# EAGLE design mutex (EAGLE 9.6.2)
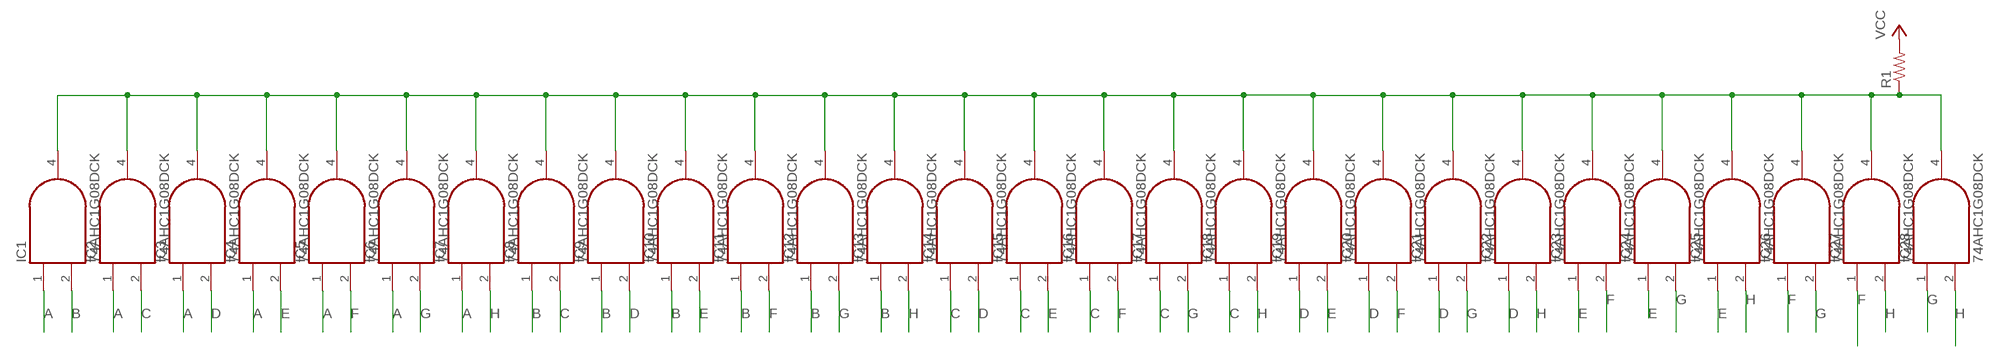
[diagram p0: schematic, sheet 1]

## Parts
IC1  74AHC1G08DCK  [SC70-5]
IC2  74AHC1G08DCK  [SC70-5]
IC3  74AHC1G08DCK  [SC70-5]
IC4  74AHC1G08DCK  [SC70-5]
IC5  74AHC1G08DCK  [SC70-5]
IC6  74AHC1G08DCK  [SC70-5]
IC7  74AHC1G08DCK  [SC70-5]
IC8  74AHC1G08DCK  [SC70-5]
IC9  74AHC1G08DCK  [SC70-5]
IC10  74AHC1G08DCK  [SC70-5]
IC11  74AHC1G08DCK  [SC70-5]
IC12  74AHC1G08DCK  [SC70-5]
IC13  74AHC1G08DCK  [SC70-5]
IC14  74AHC1G08DCK  [SC70-5]
IC15  74AHC1G08DCK  [SC70-5]
IC16  74AHC1G08DCK  [SC70-5]
IC17  74AHC1G08DCK  [SC70-5]
IC18  74AHC1G08DCK  [SC70-5]
IC19  74AHC1G08DCK  [SC70-5]
IC20  74AHC1G08DCK  [SC70-5]
IC21  74AHC1G08DCK  [SC70-5]
IC22  74AHC1G08DCK  [SC70-5]
IC23  74AHC1G08DCK  [SC70-5]
IC24  74AHC1G08DCK  [SC70-5]
IC25  74AHC1G08DCK  [SC70-5]
IC26  74AHC1G08DCK  [SC70-5]
IC27  74AHC1G08DCK  [SC70-5]
IC28  74AHC1G08DCK  [SC70-5]
R1  R-US_0207/7  [0207/7]

## Nets
A: IC1.1(I0) IC2.1(I0) IC3.1(I0) IC4.1(I0) IC5.1(I0) IC6.1(I0) IC7.1(I0)
B: IC1.2(I1) IC8.1(I0) IC9.1(I0) IC10.1(I0) IC11.1(I0) IC12.1(I0) IC13.1(I0)
C: IC2.2(I1) IC8.2(I1) IC14.1(I0) IC15.1(I0) IC16.1(I0) IC17.1(I0) IC18.1(I0)
D: IC3.2(I1) IC9.2(I1) IC14.2(I1) IC19.1(I0) IC20.1(I0) IC21.1(I0) IC22.1(I0)
E: IC4.2(I1) IC10.2(I1) IC15.2(I1) IC19.2(I1) IC23.1(I0) IC24.1(I0) IC25.1(I0)
F: IC5.2(I1) IC11.2(I1) IC16.2(I1) IC20.2(I1) IC23.2(I1) IC26.1(I0) IC27.1(I0)
G: IC6.2(I1) IC12.2(I1) IC17.2(I1) IC21.2(I1) IC24.2(I1) IC26.2(I1) IC28.1(I0)
H: IC7.2(I1) IC13.2(I1) IC18.2(I1) IC22.2(I1) IC25.2(I1) IC27.2(I1) IC28.2(I1)
N$4: IC1.4(O) IC2.4(O) IC3.4(O) IC4.4(O) IC5.4(O) IC6.4(O) IC7.4(O) IC8.4(O) IC9.4(O) IC10.4(O) IC11.4(O) IC12.4(O) IC13.4(O) IC14.4(O) IC15.4(O) IC16.4(O) IC17.4(O) IC18.4(O) IC19.4(O) IC20.4(O) IC21.4(O) IC22.4(O) IC23.4(O) IC24.4(O) IC25.4(O) IC26.4(O) IC27.4(O) IC28.4(O) R1.1
VCC: R1.2

## Power pins joined to a net without a drawn wire
GND: IC1.3(GND) IC2.3(GND) IC3.3(GND) IC4.3(GND) IC5.3(GND) IC6.3(GND) IC7.3(GND) IC8.3(GND) IC9.3(GND) IC10.3(GND) IC11.3(GND) IC12.3(GND) IC13.3(GND) IC14.3(GND) IC15.3(GND) IC16.3(GND) IC17.3(GND) IC18.3(GND) IC19.3(GND) IC20.3(GND) IC21.3(GND) IC22.3(GND) IC23.3(GND) IC24.3(GND) IC25.3(GND) IC26.3(GND) IC27.3(GND) IC28.3(GND)
VCC: IC1.5(VCC) IC2.5(VCC) IC3.5(VCC) IC4.5(VCC) IC5.5(VCC) IC6.5(VCC) IC7.5(VCC) IC8.5(VCC) IC9.5(VCC) IC10.5(VCC) IC11.5(VCC) IC12.5(VCC) IC13.5(VCC) IC14.5(VCC) IC15.5(VCC) IC16.5(VCC) IC17.5(VCC) IC18.5(VCC) IC19.5(VCC) IC20.5(VCC) IC21.5(VCC) IC22.5(VCC) IC23.5(VCC) IC24.5(VCC) IC25.5(VCC) IC26.5(VCC) IC27.5(VCC) IC28.5(VCC)

## Library data of the parts
IC1-IC28 = 74xx-little-us:74*1G08: 2-input AND gate
R1 = rcl:R-US_: RESISTOR, American symbol; SPICEPREFIX: R

## Board
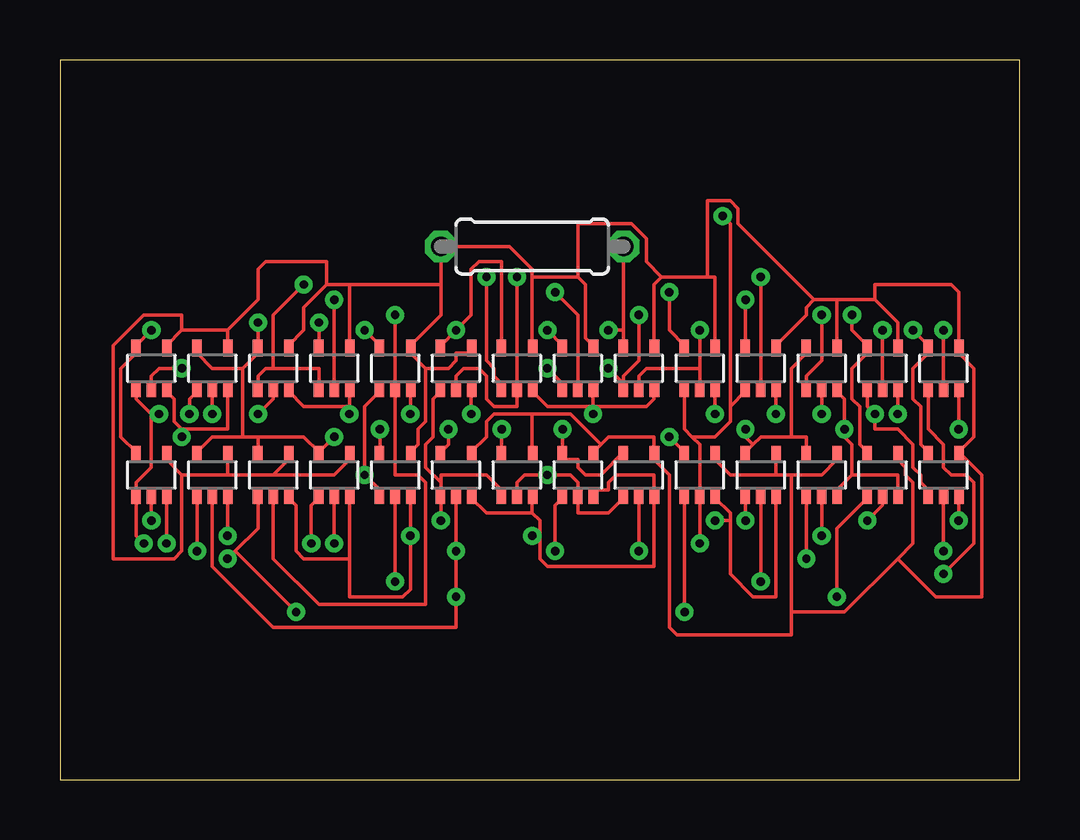
[diagram p1: board, top side]
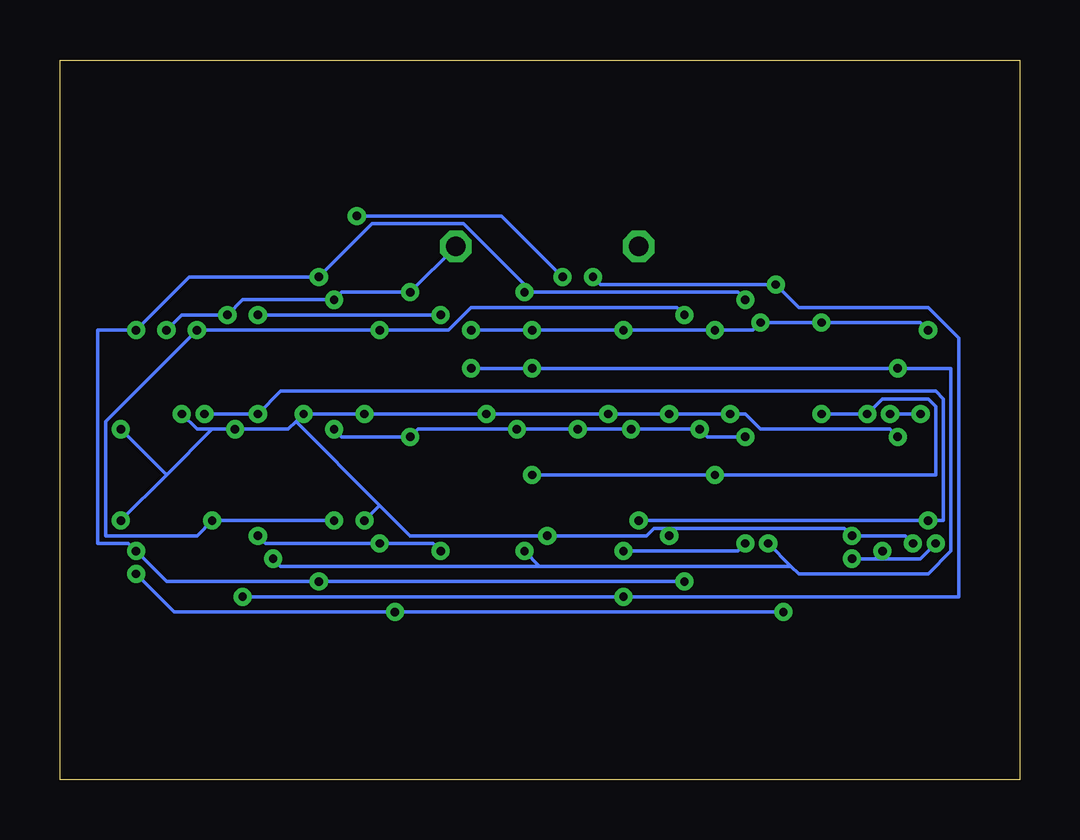
[diagram p2: board, bottom side, seen from below]

Size 40 x 30 mm. Coordinates in mm from the lower left corner, seen from the top.
Outline: 0,0 40,0 40,30 0,30 0,0
Copper layers (1*16): Top 0.035mm / dielectric 1.5mm / Bottom 0.035mm
Design rules "default": minimum track width 6mil, minimum drill 0.35mm, track to track 6mil, track to pad 6mil, pad to pad 6mil, via to via 6mil, smd to smd 6mil, copper to edge 40mil, drill to drill 6mil, minimum pad ring 10mil, minimum via ring 8mil, stop-mask expansion 4mil, vias tented up to drill 0mil, thermal gap 10mil

### Footprints (pad centres in the part's own frame; a part is rotated, then mirrored left to right if it is on the bottom)
SC70-5 = smd 0.4 x 0.7: 1 -0.65,-0.85; 2 0,-0.85; 3 0.65,-0.85; 4 0.65,0.85; 5 -0.65,0.85
0207/7 = drill 0.813 octagon: 1 -3.81,0; 2 3.81,0

### Placement (x,y rotation side)
IC1  3.81,17.14 0 top
IC2  3.81,12.7 0 top
IC3  6.35,12.7 0 top
IC4  6.35,17.14 0 top
IC5  26.67,12.7 0 top
IC6  8.89,12.7 0 top
IC7  36.83,17.14 0 top
IC8  31.75,17.14 0 top
IC9  11.43,12.7 0 top
IC10  21.59,12.7 0 top
IC11  31.75,12.7 0 top
IC12  24.13,17.14 0 top
IC13  21.59,17.14 0 top
IC14  16.51,12.7 0 top
IC15  19.05,12.7 0 top
IC16  16.51,17.14 0 top
IC17  34.29,17.14 0 top
IC18  36.83,12.7 0 top
IC19  8.89,17.14 0 top
IC20  19.05,17.14 0 top
IC21  34.29,12.7 0 top
IC22  11.43,17.14 0 top
IC23  24.13,12.7 0 top
IC24  13.97,17.14 0 top
IC25  13.97,12.7 0 top
IC26  26.67,17.14 0 top
IC27  29.21,17.14 0 top
IC28  29.21,12.7 0 top
R1  19.68,22.23 0 top

### Tracks (layer width: path | path; a pad name or v marks a point on that pad's centre or on a via)
A  (via drill 0.35)
  Top 0.152: 3.81,15.24 3.81,13.02 3.17,12.38 3.17,12.06 IC2.1 3.17,11.75 3.17,10.16 v3.49,9.84 | 3.81,15.24 3.17,15.88 3.17,16.19 IC1.1 | v5.4,15.24 5.4,15.88 5.71,16.19 IC4.1 | 3.81,15.24 v4.13,15.24 | v5.71,9.53 5.71,11.75 IC3.1 | 7.3,9.53 8.26,10.48 8.26,11.75 IC6.1 | 7.3,9.53 v6.99,9.21 | v26.04,6.99 26.04,11.75 IC5.1 | 7.3,9.53 v9.84,6.99 | v36.83,8.57 38.1,9.84 38.1,12.38 37.78,12.7 37.15,12.7 36.83,13.02 36.83,13.97 36.2,14.61 36.2,16.19 IC7.1
  Bottom 0.152: v4.13,15.24 v5.4,15.24 | 6.03,9.21 v5.71,9.53 | v6.99,9.21 6.03,9.21 | v9.84,6.99 v26.04,6.99 35.24,6.99 v36.83,8.57 | v3.49,9.84 4.13,9.21 6.03,9.21
B  (via drill 0.35)
  Top 0.152: IC1.2 3.81,16.83 4.13,17.14 v5.08,17.14 | v20.32,17.14 20.95,16.51 IC13.1 | v10.48,9.84 10.48,11.43 10.79,11.75 IC9.1 | v20.64,9.53 20.64,11.43 20.95,11.75 IC10.1 | v22.86,17.14 23.5,16.51 | v31.11,9.21 31.11,11.75 IC11.1 | v31.75,19.37 31.75,17.46 31.11,16.83 31.11,16.51 IC8.1 | v24.13,19.37 24.13,17.46 23.5,16.83 23.5,16.51 | 23.5,16.51 IC12.1
  Bottom 0.152: 9.53,8.89 9.21,8.57 3.81,8.57 2.86,9.53 2.86,17.14 v5.08,17.14 v20.32,17.14 v22.86,17.14 | 9.53,8.89 v10.48,9.84 | 20,8.89 v20.64,9.53 | 9.53,8.89 20,8.89 | v31.11,9.21 30.8,8.89 20,8.89 | v24.13,19.37 v31.75,19.37
C  (via drill 0.35)
  Top 0.152: v31.75,15.24 IC8.2 | IC17.1 33.66,16.19 33.66,15.56 v33.97,15.24 33.97,14.61 34.92,14.61 35.56,13.97 35.56,13.02 35.88,12.7 35.88,12.38 36.2,12.06 IC18.1 | v3.81,10.79 IC2.2 | v15.88,10.79 15.88,11.75 IC14.1 15.88,12.06 15.88,12.38 | 15.88,12.38 15.88,12.7 17.78,12.7 18.41,12.06 IC15.1 | 15.88,12.38 15.24,13.02 15.24,13.97 15.56,14.29 15.56,15.88 15.88,16.19 IC16.1
  Bottom 0.152: v33.97,15.24 v31.75,15.24 30.8,16.19 3.49,16.19 3.17,15.88 3.17,10.79 v3.81,10.79 v15.88,10.79
D  (via drill 0.35)
  Top 0.152: 8.89,17.14 10.79,17.14 10.79,16.51 IC22.1 | 8.89,17.14 8.57,17.14 8.26,16.83 8.26,16.51 IC19.1 | v17.78,20.95 17.78,17.46 18.1,17.14 18.1,16.83 18.41,16.51 IC20.1 | v10.16,20.64 8.89,19.37 8.89,17.14 | IC3.2 6.35,8.89 8.89,6.35 16.51,6.35 v16.51,7.62 v16.51,9.53 IC14.2 | v11.43,9.84 IC9.2 | v32.38,7.62 32.38,10.48 33.66,11.75 IC21.1
  Bottom 0.152: v17.78,20.95 17.46,20.64 v10.16,20.64 9.21,19.68 3.81,19.68 2.54,18.41 2.54,7.62 v16.51,7.62 v32.38,7.62 | v11.43,9.84 11.75,9.53 v16.51,9.53
E  (via drill 0.35)
  Top 0.152: IC15.2 19.05,12.38 19.37,12.7 v20.32,12.7 21.27,12.7 21.59,12.38 IC10.2 21.59,11.11 22.86,11.11 23.5,11.75 IC23.1 | v6.35,15.24 IC4.2 | v8.26,15.24 8.89,15.88 IC19.2 | IC25.1 13.34,12.06 v12.7,12.7 12.7,15.56 13.34,16.19 IC24.1
  Bottom 0.152: v8.26,15.24 v6.35,15.24 5.71,15.88 3.81,15.88 3.49,15.56 3.49,12.7 v12.7,12.7 v20.32,12.7
F  (via drill 0.35)
  Top 0.152: IC16.2 16.51,16.83 16.83,17.14 17.46,17.14 17.78,16.83 17.78,15.88 18.1,15.56 19.05,15.56 IC20.2 v19.05,20.95 | v24.13,9.53 IC23.2 | v26.67,9.84 IC5.2 26.67,13.97 26.35,14.29 | 26.35,14.29 26.04,14.61 26.04,16.19 IC26.1 | v31.75,10.16 IC11.2 | 27.94,15.56 28.57,16.19 IC27.1 | 27.94,15.56 27.94,14.92 27.3,14.29 26.35,14.29 | v27.62,23.5 27.94,23.18 27.94,15.56
  Bottom 0.152: v24.13,9.53 24.45,9.84 v26.67,9.84 31.43,9.84 v31.75,10.16 | v19.05,20.95 21.59,23.5 v27.62,23.5
G  (via drill 0.35)
  Top 0.152: IC6.2 8.89,9.21 10.79,7.3 15.24,7.3 15.24,12.38 14.92,12.7 13.97,12.7 IC24.2 v13.97,19.37 | IC12.2 24.13,16.83 24.45,17.14 26.67,17.14 | IC26.2 26.67,17.14 | v28.57,10.79 28.57,11.75 IC28.1 | v33.66,10.79 34.29,11.43 IC21.2 | v34.29,18.73 IC17.2 | v26.67,18.73 26.67,17.14
  Bottom 0.152: v28.57,10.79 v33.66,10.79 34.29,10.16 38.1,10.16 38.1,14.92 v34.29,18.73 v26.67,18.73 23.81,18.73 22.86,19.68 14.29,19.68 v13.97,19.37
GND  (via drill 0.35)
  Top 0.152: 19.68,11.11 17.78,11.11 17.14,11.75 IC14.3 | 19.68,11.11 19.68,11.75 IC15.3 | IC10.3 22.23,12.06 22.86,12.06 22.86,12.38 23.18,12.7 24.77,12.7 24.77,12.06 IC23.3 24.77,11.75 24.77,8.89 20.32,8.89 20,9.21 20,10.16 | 19.68,11.11 20,10.79 20,10.16 | 12.06,9.21 10.16,9.21 9.84,9.53 9.84,11.43 9.53,11.75 IC6.3 | 12.06,9.21 12.06,11.75 IC9.3 | 12.06,9.21 12.06,7.62 14.29,7.62 14.61,7.94 v14.61,10.16 14.61,11.75 IC25.3 | 33.02,12.7 32.38,12.06 IC11.3 | 33.02,12.7 34.92,12.7 34.92,12.06 IC21.3 | 33.02,12.7 33.02,13.97 32.7,14.29 v32.7,14.61 32.7,15.88 32.38,16.19 IC8.3 | 27.94,10.79 27.94,8.57 28.89,7.62 29.84,7.62 29.84,11.75 IC28.3 | 27.94,10.79 27.94,11.11 27.3,11.75 IC5.3 | 22.23,15.56 20.32,15.56 19.68,16.19 IC20.3 | 22.23,15.56 22.23,16.19 IC13.3 | 22.23,15.56 24.45,15.56 24.77,15.88 24.77,16.19 IC12.3 | v4.45,9.84 4.45,11.75 IC2.3 | v6.99,10.16 6.99,11.75 IC3.3 | 5.08,14.61 4.76,14.92 4.76,15.88 4.45,16.19 IC1.3 | 5.08,14.61 6.99,14.61 6.99,16.19 IC4.3 | 12.06,15.56 10.16,15.56 9.53,16.19 IC19.3 | 12.06,15.56 12.06,16.19 IC22.3 | v14.61,15.24 14.61,16.19 IC24.3 | 12.06,15.56 v12.06,15.24 | v17.14,15.24 17.14,16.19 IC16.3 | v27.3,15.24 27.3,16.19 IC26.3 | v29.84,15.24 29.84,16.19 IC27.3 | v34.92,15.24 34.92,16.19 IC17.3 | v37.47,10.79 37.47,11.75 IC18.3 | v37.47,14.61 37.47,16.19 IC7.3 | v5.08,14.29 5.08,14.61 | v22.23,15.24 22.23,15.56 | v27.3,10.79 27.94,10.79 | v19.68,10.16 20,10.16
  Bottom 0.152: v4.45,9.84 4.76,10.16 v6.99,10.16 7.3,10.48 14.61,10.48 | v34.92,15.24 34.29,14.61 33.66,14.61 | 33.66,14.61 v32.7,14.61 30.48,14.61 30.16,14.92 | 30.16,14.92 v29.84,15.24 v27.3,15.24 v22.23,15.24 v17.14,15.24 v14.61,15.24 v12.06,15.24 11.43,15.24 10.79,14.61 5.4,14.61 v5.08,14.29 | 33.66,14.61 35.56,12.7 | 35.56,12.7 v37.47,10.79 | 35.56,12.7 v37.47,14.61 | 14.61,10.48 15.24,10.48 15.56,10.16 v19.68,10.16 25.4,10.16 26.67,11.43 | 30.16,14.92 26.67,11.43 | 26.67,11.43 v27.3,10.79 | 14.61,10.48 v14.61,10.16
H  (via drill 0.35)
  Top 0.152: v13.97,8.26 IC25.2 | IC28.2 v29.21,8.26 | v36.83,9.53 IC18.2 | v11.43,20 IC22.2 | v20.64,20.32 21.59,19.37 IC13.2 | v29.21,20.95 IC27.2 | v36.83,18.73 IC7.2
  Bottom 0.152: v13.97,8.26 v29.21,8.26 35.56,8.26 v36.83,9.53 37.15,9.84 38.42,9.84 38.42,18.73 v36.83,18.73 34.61,20.95 v29.21,20.95 26.99,23.18 23.18,23.18 20.32,20.32 | v11.43,20 11.75,20.32 20.32,20.32 | 20.32,20.32 v20.64,20.32
N$4
  Top 0.152: 22.54,13.97 22.86,14.29 24.77,14.29 24.77,13.65 IC23.4 24.77,13.34 25.4,12.7 25.4,6.35 25.72,6.03 30.48,6.03 30.48,6.99 | 22.54,13.97 22.23,13.65 IC10.4 | 19.68,15.24 18.1,15.24 17.78,14.92 17.78,14.29 17.14,13.65 IC14.4 | 19.68,15.24 19.68,13.65 IC15.4 | 22.54,13.97 21.27,15.24 19.68,15.24 | 29.84,12.7 27.94,12.7 27.3,13.34 IC5.4 | 29.84,12.7 29.84,13.34 IC28.4 | 29.84,12.7 30.48,12.7 | 30.48,12.7 31.75,12.7 32.38,13.34 IC11.4 | 34.92,9.21 32.7,6.99 30.48,6.99 | 34.92,9.21 35.56,9.84 35.56,12.38 35.24,12.7 35.24,13.02 34.92,13.34 IC21.4 | 30.48,12.7 30.48,6.99 | 5.08,12.7 4.45,13.34 IC2.4 | 6.99,12.7 5.08,12.7 | 6.99,12.7 6.99,13.34 IC3.4 | 8.89,12.7 9.53,13.34 IC6.4 | 6.99,12.7 8.89,12.7 | 8.89,12.7 11.43,12.7 12.06,13.34 IC9.4 | 5.08,18.73 4.45,18.1 IC1.4 | 6.99,18.73 5.08,18.73 | 6.99,18.73 6.99,18.1 IC4.4 | 11.11,20.64 10.16,19.68 10.16,18.73 9.53,18.1 IC19.4 | 12.06,20.64 11.11,20.64 | 12.06,20.64 12.06,18.1 IC22.4 | 6.99,18.73 8.26,20 8.26,21.27 8.57,21.59 11.11,21.59 11.11,20.64 | 5.08,12.7 5.08,9.53 4.76,9.21 2.22,9.21 2.22,18.1 3.49,19.37 5.08,19.37 5.08,18.73 | 37.47,13.65 38.1,14.29 38.1,17.14 37.47,17.78 IC7.4 37.47,18.1 37.47,20.32 37.15,20.64 33.97,20.64 33.97,20 | 31.43,20 31.11,19.68 31.11,19.37 29.84,18.1 IC27.4 | 32.38,20 31.43,20 | 32.38,20 32.38,18.1 IC8.4 | 33.97,20 34.92,19.05 34.92,18.1 IC17.4 | 32.38,20 33.97,20 | 15.24,17.14 15.24,14.92 14.92,14.61 14.92,13.97 14.61,13.65 IC25.4 | 15.24,17.14 14.61,17.78 IC24.4 14.61,18.1 15.88,19.37 15.88,20.64 | 15.24,17.14 16.19,17.14 16.51,17.46 16.51,17.78 17.14,17.78 IC16.4 | 25.08,20.95 24.77,20.64 24.77,18.1 IC12.4
  Top 0.152: 26.99,20.95 27.3,20.95 27.3,18.1 IC26.4 | 26.99,20.95 25.08,20.95 | 19.68,20.95 19.68,21.27 18.73,22.23 R1.1 15.88,20.64 | 19.68,20.95 19.68,18.1 IC20.4 | 21.59,20.95 21.91,20.64 21.91,18.41 22.23,18.1 IC13.4 | 19.68,20.95 21.59,20.95 | 25.08,20.95 24.45,21.59 24.45,22.54 23.81,23.18 21.59,23.18 21.59,20.95 | 31.43,20 28.26,23.18 28.26,23.81 27.94,24.13 26.99,24.13 26.99,20.95 | 15.88,20.64 12.06,20.64 | 34.92,9.21 36.51,7.62 38.42,7.62 38.42,12.7 37.47,13.65 | 37.47,13.65 IC18.4
VCC  (via drill 0.35)
  Top 0.152: 28.89,13.97 29.21,14.29 30.48,14.29 | 28.89,13.97 28.57,13.65 IC28.5 | 30.48,14.29 31.11,14.29 31.11,13.65 IC11.5 | 30.48,14.29 30.48,17.14 31.11,17.78 IC8.5 | IC23.5 23.5,13.65 22.54,12.7 21.91,12.7 21.59,13.02 21.59,13.34 20.95,13.34 IC10.5 20.95,13.65 v20.95,14.61 | 8.26,14.29 7.62,14.29 | 7.62,14.29 6.35,14.29 5.71,13.65 IC3.5 | 8.26,14.29 8.26,13.65 IC6.5 | 10.79,13.65 10.16,14.29 8.26,14.29 | 7.62,17.14 6.35,17.14 5.71,17.78 IC4.5 | 7.62,14.29 7.62,17.14 | 7.62,17.14 8.26,17.78 IC19.5 8.26,18.1 v8.26,19.05 | v13.34,14.61 13.34,13.65 IC25.5 | 10.79,13.65 v11.43,14.29 | 10.79,13.65 IC9.5 | v16.19,14.61 16.19,13.97 15.88,13.65 IC14.5 | v18.41,14.61 18.41,13.65 IC15.5 | v25.4,14.29 26.04,13.65 IC5.5 | 28.89,13.97 28.57,14.29 v28.57,14.61 | IC18.5 36.2,13.65 35.88,13.97 35.88,15.56 35.56,15.88 35.56,17.14 36.2,17.78 IC7.5 36.2,18.1 v35.56,18.73 | IC21.5 33.66,13.65 33.34,13.97 33.34,15.56 33.02,15.88 33.02,17.14 33.66,17.78 IC17.5 33.66,18.1 33.02,18.73 v33.02,19.37 | R1.2 23.5,18.73 | 23.5,18.73 23.5,18.1 IC12.5 | v25.4,20.32 25.4,18.73 26.04,18.1 IC26.5 | v28.57,20 28.57,18.1 IC27.5 | IC16.5 15.88,18.1 v16.51,18.73 17.14,19.37 17.14,21.27 17.46,21.59 18.41,21.59 18.41,18.1 IC20.5 | IC2.5 3.17,13.65 2.54,14.29 2.54,17.14 3.17,17.78 IC1.5 3.17,18.1 v3.81,18.73 | v10.79,19.05 10.79,18.1 IC22.5 | v12.7,18.73 13.34,18.1 IC24.5 | v20.32,18.73 20.95,18.1 IC13.5 | v22.86,18.73 23.5,18.73
  Bottom 0.152: v11.43,14.29 13.02,14.29 v13.34,14.61 v16.19,14.61 v18.41,14.61 v20.95,14.61 25.08,14.61 v25.4,14.29 28.26,14.29 v28.57,14.61 | R1.2 v25.4,20.32 28.26,20.32 v28.57,20 32.38,20 v33.02,19.37 34.92,19.37 v35.56,18.73 | v3.81,18.73 4.13,19.05 v8.26,19.05 v10.79,19.05 11.11,18.73 v12.7,18.73 v16.51,18.73 v20.32,18.73 v22.86,18.73